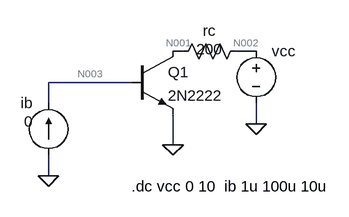
[diagram p0: schematic bjt_char.asc]
bjt_char.asc, the LTspice schematic file:
Version 4
SHEET 1 880 680
WIRE 224 128 208 128
WIRE 336 128 304 128
WIRE 144 176 16 176
WIRE 16 208 16 176
WIRE 336 240 336 208
WIRE 208 272 208 224
WIRE 16 320 16 288
FLAG 208 272 0
FLAG 16 320 0
FLAG 336 240 0
SYMBOL npn 144 128 R0
SYMATTR InstName Q1
SYMATTR Value 2N2222
SYMBOL voltage 336 112 R0
WINDOW 3 24 44 Left 2
WINDOW 123 0 0 Left 2
WINDOW 39 0 0 Left 2
SYMATTR Value ""
SYMATTR InstName vcc
SYMBOL current 16 288 R180
WINDOW 0 24 80 Left 2
WINDOW 3 24 52 Left 2
WINDOW 123 0 0 Left 2
WINDOW 39 0 0 Left 2
SYMATTR InstName ib
SYMATTR Value 0
SYMBOL res 320 112 R90
WINDOW 0 0 56 VBottom 2
WINDOW 3 28 56 VBottom 2
SYMATTR InstName rc
SYMATTR Value 200
TEXT 144 336 Left 2 !.dc vcc 0 10  ib 1u 100u 10u

The netlist it stands for:
* bjt_char.asc
Q1 N001 N003 0 0 2N2222
vcc N002 0
ib 0 N003 0
rc N002 N001 200
.model NPN NPN
.model PNP PNP
.lib standard.bjt
.dc vcc 0 10  ib 1u 100u 10u
.backanno
.end

* Results of the author's LTspice run, read from the files saved beside the schematic
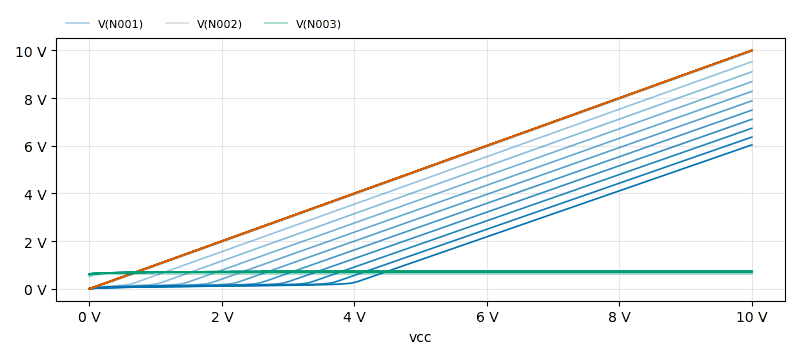
[diagram p1: DC transfer characteristic of bjt_char.asc, plotted from the saved traces]
* DC transfer characteristic, 11 runs:
*   V(N001) [ib=1e-006]: 192.6 µV at vcc=0 V, 9.956 V at vcc=10 V, min 192.6 µV, max 9.956 V
*   V(N001) [ib=1.1e-005]: 1.721 mV at vcc=0 V, 9.525 V at vcc=10 V, min 1.721 mV, max 9.525 V
*   V(N001) [ib=2.1e-005]: 2.749 mV at vcc=0 V, 9.102 V at vcc=10 V, min 2.749 mV, max 9.102 V
*   V(N001) [ib=3.1e-005]: 3.478 mV at vcc=0 V, 8.688 V at vcc=10 V, min 3.478 mV, max 8.688 V
*   V(N001) [ib=4.1e-005]: 4.019 mV at vcc=0 V, 8.282 V at vcc=10 V, min 4.019 mV, max 8.282 V
*   V(N001) [ib=5.1e-005]: 4.435 mV at vcc=0 V, 7.884 V at vcc=10 V, min 4.435 mV, max 7.884 V
*   V(N001) [ib=6.1e-005]: 4.764 mV at vcc=0 V, 7.493 V at vcc=10 V, min 4.764 mV, max 7.493 V
*   V(N001) [ib=7.1e-005]: 5.03 mV at vcc=0 V, 7.11 V at vcc=10 V, min 5.03 mV, max 7.11 V
*   V(N002) [ib=1e-006]: 0 V at vcc=0 V, 10 V at vcc=10 V, min 0 V, max 10 V
*   V(N002) [ib=1.1e-005]: 0 V at vcc=0 V, 10 V at vcc=10 V, min 0 V, max 10 V
*   V(N002) [ib=2.1e-005]: 0 V at vcc=0 V, 10 V at vcc=10 V, min 0 V, max 10 V
*   V(N002) [ib=3.1e-005]: 0 V at vcc=0 V, 10 V at vcc=10 V, min 0 V, max 10 V
*   V(N002) [ib=4.1e-005]: 0 V at vcc=0 V, 10 V at vcc=10 V, min 0 V, max 10 V
*   V(N002) [ib=5.1e-005]: 0 V at vcc=0 V, 10 V at vcc=10 V, min 0 V, max 10 V
*   V(N002) [ib=6.1e-005]: 0 V at vcc=0 V, 10 V at vcc=10 V, min 0 V, max 10 V
*   V(N002) [ib=7.1e-005]: 0 V at vcc=0 V, 10 V at vcc=10 V, min 0 V, max 10 V
*   V(N003) [ib=1e-006]: 504.7 mV at vcc=0 V, 613.5 mV at vcc=10 V, min 504.7 mV, max 613.5 mV
*   V(N003) [ib=1.1e-005]: 568.3 mV at vcc=0 V, 676.1 mV at vcc=10 V, min 568.3 mV, max 676.1 mV
*   V(N003) [ib=2.1e-005]: 586.1 mV at vcc=0 V, 693.3 mV at vcc=10 V, min 586.1 mV, max 693.3 mV
*   V(N003) [ib=3.1e-005]: 597 mV at vcc=0 V, 703.9 mV at vcc=10 V, min 597 mV, max 703.9 mV
*   V(N003) [ib=4.1e-005]: 604.9 mV at vcc=0 V, 711.7 mV at vcc=10 V, min 604.9 mV, max 711.7 mV
*   V(N003) [ib=5.1e-005]: 611.1 mV at vcc=0 V, 717.8 mV at vcc=10 V, min 611.1 mV, max 717.8 mV
*   V(N003) [ib=6.1e-005]: 616.1 mV at vcc=0 V, 722.9 mV at vcc=10 V, min 616.1 mV, max 722.9 mV
*   V(N003) [ib=7.1e-005]: 620.4 mV at vcc=0 V, 727.4 mV at vcc=10 V, min 620.4 mV, max 727.4 mV